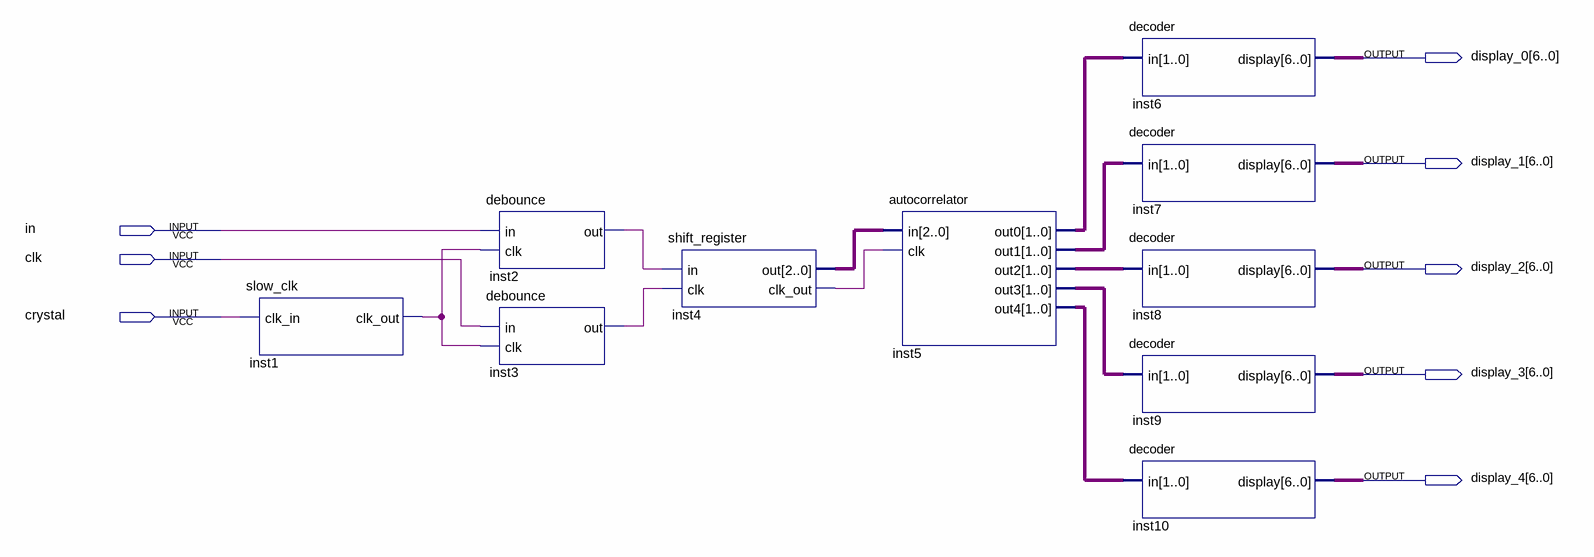
[diagram p0: schematic sheet]
// Quartus schematic Autocorrelation.bdf as structural Verilog: 10 symbols, 8 pins
module Autocorrelation (
  input  in,
  input  clk,
  input  crystal,
  output [6:0] display_0,
  output [6:0] display_1,
  output [6:0] display_2,
  output [6:0] display_3,
  output [6:0] display_4
);

  wire inst1_clk_out, inst2_out, inst3_out, inst4_clk_out;
  wire [1:0] inst5_out0, inst5_out1, inst5_out2, inst5_out3, inst5_out4;
  wire [2:0] inst4_out;

  slow_clk inst1 (.clk_in(crystal), .clk_out(inst1_clk_out));
  debounce inst2 (.in(in), .clk(inst1_clk_out), .out(inst2_out));
  debounce inst3 (.in(clk), .clk(inst1_clk_out), .out(inst3_out));
  shift_register inst4 (.in(inst2_out), .clk(inst3_out), .out(inst4_out), .clk_out(inst4_clk_out));
  autocorrelator inst5 (
    .in(inst4_out), .clk(inst4_clk_out), .out0(inst5_out0), .out1(inst5_out1), .out2(inst5_out2),
    .out3(inst5_out3), .out4(inst5_out4));
  decoder inst6 (.in(inst5_out0), .display(display_0));
  decoder inst7 (.in(inst5_out1), .display(display_1));
  decoder inst8 (.in(inst5_out2), .display(display_2));
  decoder inst9 (.in(inst5_out3), .display(display_3));
  decoder inst10 (.in(inst5_out4), .display(display_4));
endmodule
